# Altium schematic sheet MCU.SchDoc
size A4
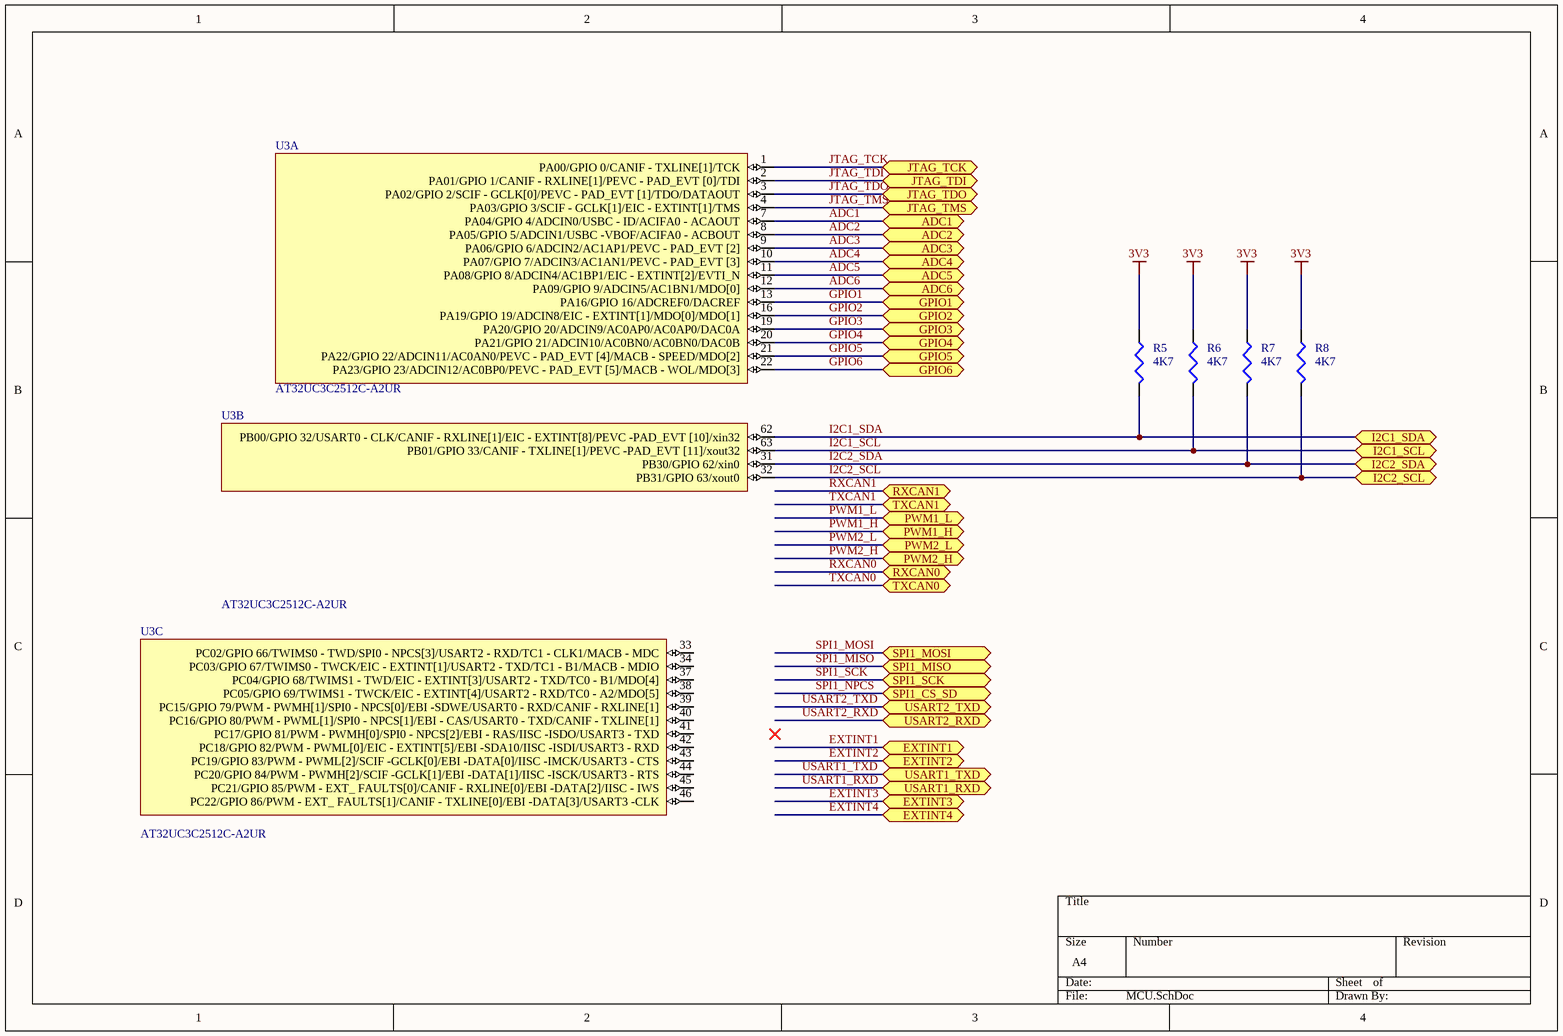
[diagram p0: MCU.SchDoc]

## Parts
(Parts that share a designator on the sheet are numbered #1, #2 ... from top to bottom, then left to right.)
R5  value 4K7  [0402R-TBD]  (hidden comment: Res3)
R6  value 4K7  [0402R-TBD]  (hidden comment: Res3)
R7  value 4K7  [0402R-TBD]  (hidden comment: Res3)
R8  value 4K7  [0402R-TBD]  (hidden comment: Res3)
U3#1  AT32UC3C2512C-A2UR  [TQFP64_N]  (part A of 6)
U3#2  AT32UC3C2512C-A2UR  [TQFP64_N]  (parts B,C of 6)

## Ports
ADC1 (bidir), ADC2 (bidir), ADC3 (bidir), ADC4 (bidir), ADC5 (bidir), ADC6 (bidir), EXTINT1 (bidir), EXTINT2 (bidir), EXTINT3 (bidir), EXTINT4 (bidir), GPIO1 (bidir), GPIO2 (bidir), GPIO3 (bidir), GPIO4 (bidir), GPIO5 (bidir), GPIO6 (bidir), I2C1_SCL (bidir), I2C1_SDA (bidir), I2C2_SCL (bidir), I2C2_SDA (bidir), JTAG_TCK (bidir), JTAG_TDI (bidir), JTAG_TDO (bidir), JTAG_TMS (bidir), PWM1_H (bidir), PWM1_L (bidir), PWM2_H (bidir), PWM2_L (bidir), RXCAN0 (bidir), RXCAN1 (bidir), SPI1_CS_SD (bidir), SPI1_MISO (bidir), SPI1_MOSI (bidir), SPI1_SCK (bidir), TXCAN0 (bidir), TXCAN1 (bidir), USART1_RXD (bidir), USART1_TXD (bidir), USART2_RXD (bidir), USART2_TXD (bidir)

## Nets
3V3: R5.1 R6.1 R7.1 R8.1
ADC1: U3#1.7(PA04/GPIO_4/ADCIN0/USBC_-_ID/ACIFA0_-_ACAOUT) ; port ADC1
ADC2: U3#1.8(PA05/GPIO_5/ADCIN1/USBC_-VBOF/ACIFA0_-_ACBOUT) ; port ADC2
ADC3: U3#1.9(PA06/GPIO_6/ADCIN2/AC1AP1/PEVC_-_PAD_EVT_[2]) ; port ADC3
ADC4: U3#1.10(PA07/GPIO_7/ADCIN3/AC1AN1/PEVC_-_PAD_EVT_[3]) ; port ADC4
ADC5: U3#1.11(PA08/GPIO_8/ADCIN4/AC1BP1/EIC_-_EXTINT[2]/EVTI_N) ; port ADC5
ADC6: U3#1.12(PA09/GPIO_9/ADCIN5/AC1BN1/MDO[0]) ; port ADC6
EXTINT1: port EXTINT1
EXTINT2: port EXTINT2
EXTINT3: port EXTINT3
EXTINT4: port EXTINT4
GPIO1: U3#1.13(PA16/GPIO_16/ADCREF0/DACREF) ; port GPIO1
GPIO2: U3#1.16(PA19/GPIO_19/ADCIN8/EIC_-_EXTINT[1]/MDO[0]/MDO[1]) ; port GPIO2
GPIO3: U3#1.19(PA20/GPIO_20/ADCIN9/AC0AP0/AC0AP0/DAC0A) ; port GPIO3
GPIO4: U3#1.20(PA21/GPIO_21/ADCIN10/AC0BN0/AC0BN0/DAC0B) ; port GPIO4
GPIO5: U3#1.21(PA22/GPIO_22/ADCIN11/AC0AN0/PEVC_-_PAD_EVT_[4]/MACB_-_SPEED/MDO[2]) ; port GPIO5
GPIO6: U3#1.22(PA23/GPIO_23/ADCIN12/AC0BP0/PEVC_-_PAD_EVT_[5]/MACB_-_WOL/MDO[3]) ; port GPIO6
I2C1_SCL: R6.2 U3#2.63(PB01/GPIO_33/CANIF_-_TXLINE[1]/PEVC_-PAD_EVT_[11]/xout32) ; port I2C1_SCL
I2C1_SDA: R5.2 U3#2.62(PB00/GPIO_32/USART0_-_CLK/CANIF_-_RXLINE[1]/EIC_-_EXTINT[8]/PEVC_-PAD_EVT_[10]/xin32) ; port I2C1_SDA
I2C2_SCL: R8.2 U3#2.32(PB31/GPIO_63/xout0) ; port I2C2_SCL
I2C2_SDA: R7.2 U3#2.31(PB30/GPIO_62/xin0) ; port I2C2_SDA
JTAG_TCK: U3#1.1(PA00/GPIO_0/CANIF_-_TXLINE[1]/TCK) ; port JTAG_TCK
JTAG_TDI: U3#1.2(PA01/GPIO_1/CANIF_-_RXLINE[1]/PEVC_-_PAD_EVT_[0]/TDI) ; port JTAG_TDI
JTAG_TDO: U3#1.3(PA02/GPIO_2/SCIF_-_GCLK[0]/PEVC_-_PAD_EVT_[1]/TDO/DATAOUT) ; port JTAG_TDO
JTAG_TMS: U3#1.4(PA03/GPIO_3/SCIF_-_GCLK[1]/EIC_-_EXTINT[1]/TMS) ; port JTAG_TMS
PWM1_H: port PWM1_H
PWM1_L: port PWM1_L
PWM2_H: port PWM2_H
PWM2_L: port PWM2_L
RXCAN0: port RXCAN0
RXCAN1: port RXCAN1
SPI1_MISO: port SPI1_MISO
SPI1_MOSI: port SPI1_MOSI
SPI1_NPCS: port SPI1_CS_SD
SPI1_SCK: port SPI1_SCK
TXCAN0: port TXCAN0
TXCAN1: port TXCAN1
USART1_RXD: port USART1_RXD
USART1_TXD: port USART1_TXD
USART2_RXD: port USART2_RXD
USART2_TXD: port USART2_TXD

Not connected (* = marked no-connect by the designer): U3#2 33(PC02/GPIO_66/TWIMS0_-_TWD/SPI0_-_NPCS[3]/USART2_-_RXD/TC1_-_CLK1/MACB_-_MDC) 34(PC03/GPIO_67/TWIMS0_-_TWCK/EIC_-_EXTINT[1]/USART2_-_TXD/TC1_-_B1/MACB_-_MDIO) 37(PC04/GPIO_68/TWIMS1_-_TWD/EIC_-_EXTINT[3]/USART2_-_TXD/TC0_-_B1/MDO[4]) 38(PC05/GPIO_69/TWIMS1_-_TWCK/EIC_-_EXTINT[4]/USART2_-_RXD/TC0_-_A2/MDO[5]) 39(PC15/GPIO_79/PWM_-_PWMH[1]/SPI0_-_NPCS[0]/EBI_-SDWE/USART0_-_RXD/CANIF_-_RXLINE[1]) 40(PC16/GPIO_80/PWM_-_PWML[1]/SPI0_-_NPCS[1]/EBI_-_CAS/USART0_-_TXD/CANIF_-_TXLINE[1]) 41(PC17/GPIO_81/PWM_-_PWMH[0]/SPI0_-_NPCS[2]/EBI_-_RAS/IISC_-ISDO/USART3_-_TXD) 42(PC18/GPIO_82/PWM_-_PWML[0]/EIC_-_EXTINT[5]/EBI_-SDA10/IISC_-ISDI/USART3_-_RXD) 43(PC19/GPIO_83/PWM_-_PWML[2]/SCIF_-GCLK[0]/EBI_-DATA[0]/IISC_-IMCK/USART3_-_CTS) 44(PC20/GPIO_84/PWM_-_PWMH[2]/SCIF_-GCLK[1]/EBI_-DATA[1]/IISC_-ISCK/USART3_-_RTS) 45(PC21/GPIO_85/PWM_-_EXT__FAULTS[0]/CANIF_-_RXLINE[0]/EBI_-DATA[2]/IISC_-_IWS) 46(PC22/GPIO_86/PWM_-_EXT__FAULTS[1]/CANIF_-_TXLINE[0]/EBI_-DATA[3]/USART3_-CLK)

## Library data of the parts
R5-R8 = Res3: Resistor; Published: 8-Jun-2000; LatestRevisionDate: 29-May-2009; LatestRevisionNote: IPC-7351 Footprint Added.; PackageReference: J1-0603; Publisher: Altium Limited; PackageDescription: Chip Resistor; Digi-Key Part Number: 541-120GCT-ND
U3#1 U3#2 = CMP-0092-00216-1: 32-bit AVR UC3 C Series Microcontroller, 512KB Flash, 68KB SRAM, 45 GPIO pins, Industrial Grade, 64- Pin TQFP, Reel; ComponentLink3URL: http://www.atmel.com/dyn/resources/prod_documents/32117s.pdf; PackageReference: TQFP64; ComponentLink3Description: AT32UC3C Summary; PackageVersion: 2011; DatasheetVersion: revC, Aug-2011; ComponentLink1Description: Manufacturer URL; ComponentLink2URL: http://www.atmel.com/dyn/resources/prod_documents/doc32117.pdf; ComponentLink2Description: AT32UC3C Datasheet; Code_JEDEC: MS-026; PackageDescription: 64-Pin Thin Quad Flat Pack, 10 x 10 x 1.0 mm Body, 0.5 mm Pitch; ComponentLink1URL: http://www.atmel.com/; PartId: 1